# EAGLE design FUENTE ESTACION TIERRA (EAGLE 5.07)
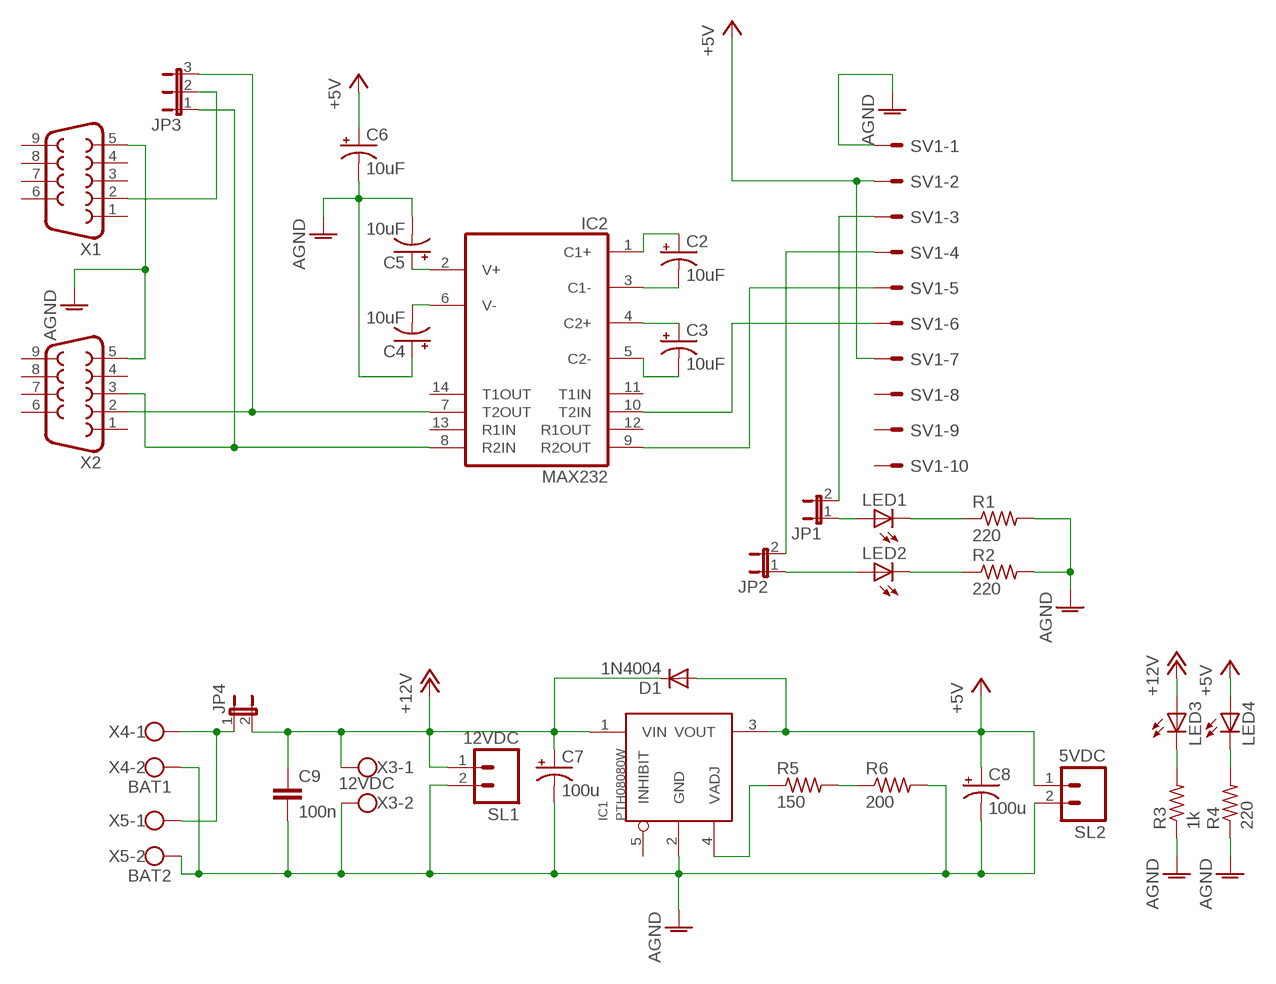
[diagram p0: schematic, sheet 1]

## Parts
C2  10uF  CPOL-USE2.5-5  [E2,5-5]
C3  10uF  CPOL-USE2.5-5  [E2,5-5]
C4  10uF  CPOL-USE2.5-5  [E2,5-5]
C5  10uF  CPOL-USE2.5-5  [E2,5-5]
C6  10uF  CPOL-USE2.5-5  [E2,5-5]
C7  100u  CPOL-USE2.5-5  [E2,5-5]
C8  100u  CPOL-USE2.5-5  [E2,5-5]
C9  100n  C5/2.5  [C5B2.5]
D1  1N4004  [DO41-10]
IC1  PTH08080W  [PLACA_XTEND_RF]
IC2  MAX232  [DIL16]
JP1  JP1E  [JP1]
JP2  JP1E  [JP1]
JP3  JP2E  [JP2]
JP4  JP1E  [JP1]
LED1  LED5MM  [LED5MM]
LED2  LED5MM  [LED5MM]
LED3  LED5MM  [LED5MM]
LED4  LED5MM  [LED5MM]
R1  220  R-US_0207/10  [0207/10]
R2  220  R-US_0207/10  [0207/10]
R3  1k  R-US_0207/10  [0207/10]
R4  220  R-US_0207/10  [0207/10]
R5  150  R-US_M1206  [M1206]
R6  200  R-US_M1206  [M1206]
SL1  12VDC  M02  [02P]
SL2  5VDC  M02  [02P]
SV1  ML10E  [ML10]
X1  F09HP  [F09HP]
X2  F09HP  [F09HP]
X3  12VDC  W237-102  [W237-102]
X4  BAT1  W237-102  [W237-102]
X5  BAT2  W237-102  [W237-102]

## Nets
+5V: C6.+ C8.+ D1.A IC1.3(VOUT) LED4.A SL2.1 SV1.2 SV1.7
+12V: C7.+ C9.1 D1.C IC1.1(VIN) JP4.2 LED3.A SL1.1 X3.1
AGND: C4.+ C5.- C6.- C7.- C8.- C9.2 IC1.2(GND) R1.2 R2.2 R3.1 R4.1 R6.2 SL1.2 SL2.2 SV1.1 X1.5 X2.5 X3.2 X4.2 X5.2
N$1: JP3.2 X1.2
N$2: JP4.1 X4.1 X5.1
N$3: C2.- IC2.3(C1-)
N$4: LED3.K(C) R3.2
N$5: LED4.K(C) R4.2
N$6: IC2.7(T2OUT) JP3.3 X2.2
N$7: IC2.8(R2IN) JP3.1 X2.3
N$8: C2.+ IC2.1(C1+)
N$9: C3.+ IC2.4(C2+)
N$10: C3.- IC2.5(C2-)
N$11: IC1.4(VADJ) R5.1
N$12: R5.2 R6.1
N$13: C5.+ IC2.2(V+)
N$14: C4.- IC2.6(V-)
N$15: IC2.10(T2IN) SV1.6
N$16: IC2.9(R2OUT) SV1.5
N$17: JP1.2 SV1.3
N$18: JP2.2 SV1.4
N$19: JP1.1 LED1.A
N$20: JP2.1 LED2.A
N$21: LED1.K(C) R1.1
N$22: LED2.K(C) R2.1
Unconnected: IC1.5(INHIBIT) IC2.11(T1IN) IC2.12(R1OUT) IC2.13(R1IN) IC2.14(T1OUT) SV1.8 SV1.9 SV1.10 X1.1 X1.3 X1.4 X1.6 X1.7 X1.8 X1.9 X2.1 X2.4 X2.6 X2.7 X2.8 X2.9

## Power pins joined to a net without a drawn wire
GND: IC2.15(GND)
VCC: IC2.16(VCC)

## Library data of the parts
C2-C8 = rcl:CPOL-US: POLARIZED CAPACITOR, American symbol
C9 = capacitor-wima:C: CAPACITOR naming: grid - package width
D1 = diode:1N4004: DIODE general purpose rectifier, 1 A
IC1 = cornejoso:PTH08080W
IC2 = maxim:MAX232: RS232 TRANSEIVER
JP1 JP2 JP4 = jumper:JP1E: JUMPER
JP3 = jumper:JP2E: JUMPER
LED1-LED4 = led:LED: LED OSRAM: - CHIPLED LG R971, LG N971, LY N971, LG Q971, LY Q971, LO R971, LY R971 LH N974, LH R974 LS Q976, LO Q976, LY Q976 LO Q996 - Hyper CHIPLED LW Q18S LB Q993, LB Q99A, LB R99A - SideLED LS A670, LO A670, LY A670, LG A670, LP A670 LB A673, LV A673, LT A673, LW A673 LH A674 LY A675 LS A676, LA A676, LO A676, LY A676, LW A676 LS A679, LY A679, LG A679 - Hyper Micro SIDELED® LS Y876, LA Y876, LO Y876, LY Y876 LT Y87S - SmartLED LW L88C, LW L88S LB L89C, LB L89S, LG L890 LS L89K, LO L89K, LY L89K LS L896, LA L896, LO L896, LY L896 - TOPLED LS T670, LO T670, LY T670, LG T670, LP T670 LSG T670, LSP T670, LSY T670, LOP T670, LYG T670 LG T671, LOG T671, LSG T671 LB T673, LV T673, LT T673, LW T673 LH T674 LS T676, LA T676, LO T676, LY T676, LB T676, LH T676, LSB T676, LW T676 LB T67C, LV T67C, LT T67C, LS T67K, LO T67K, LY T67K, LW E67C LS E67B, LA E67B, LO E67B, LY E67B, LB E67C, LV E67C, LT E67C LW T67C LS T679, LY T679, LG T679 LS T770, LO T770, LY T770, LG T770, LP T770 LB T773, LV T773, LT T773, LW T773 LH T774 LS E675, LA E675, LY E675, LS T675 LS T776, LA T776, LO T776, LY T776, LB T776 LHGB T686 LT T68C, LB T68C - Hyper Mini TOPLED® LB M676 - Mini TOPLED Santana® LG M470 LS M47K, LO M47K, LY M47K Source: http://www.osram.convergy.de LUXEON: - LUMILED® LXK2-PW12-R00, LXK2-PW12-S00, LXK2-PW14-U00, LXK2-PW14-V00 LXK2-PM12-R00, LXK2-PM12-S00, LXK2-PM14-U00 LXK2-PE12-Q00, LXK2-PE12-R00, LXK2-PE12-S00, LXK2-PE14-T00, LXK2-PE14-U00 LXK2-PB12-K00, LXK2-PB12-L00, LXK2-PB12-M00, LXK2-PB14-N00, LXK2-PB14-P00, LXK2-PB14-Q00 LXK2-PR12-L00, LXK2-PR12-M00, LXK2-PR14-Q00, LXK2-PR14-R00 LXK2-PD12-Q00, LXK2-PD12-R00, LXK2-PD12-S00 LXK2-PH12-R00, LXK2-PH12-S00 LXK2-PL12-P00, LXK2-PL12-Q00, LXK2-PL12-R00 Source: www.luxeon.com KINGBRIGHT: KA-3528ASYC Source: www.kingbright.com
R1-R6 = rcl:R-US_: RESISTOR, American symbol
SL1 SL2 = con-amp-quick:M02: AMP QUICK CONNECTOR
SV1 = con-ml:ML10E: HARTING
X1 X2 = con-subd:F09: SUB-D
X3-X5 = con-wago-500:W237-102: WAGO SCREW CLAMP

## Board
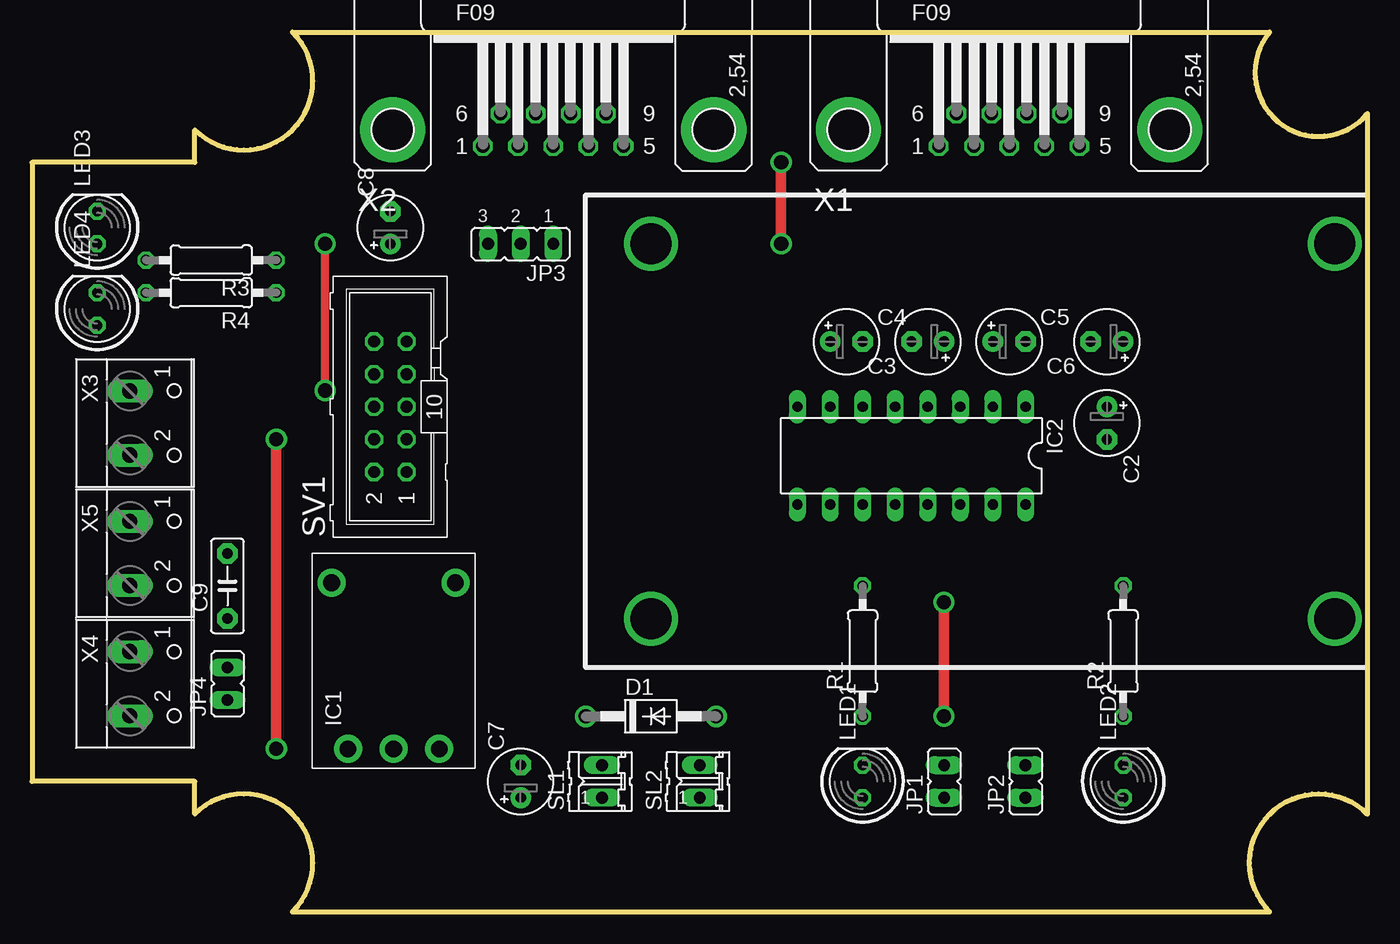
[diagram p1: board, top side]
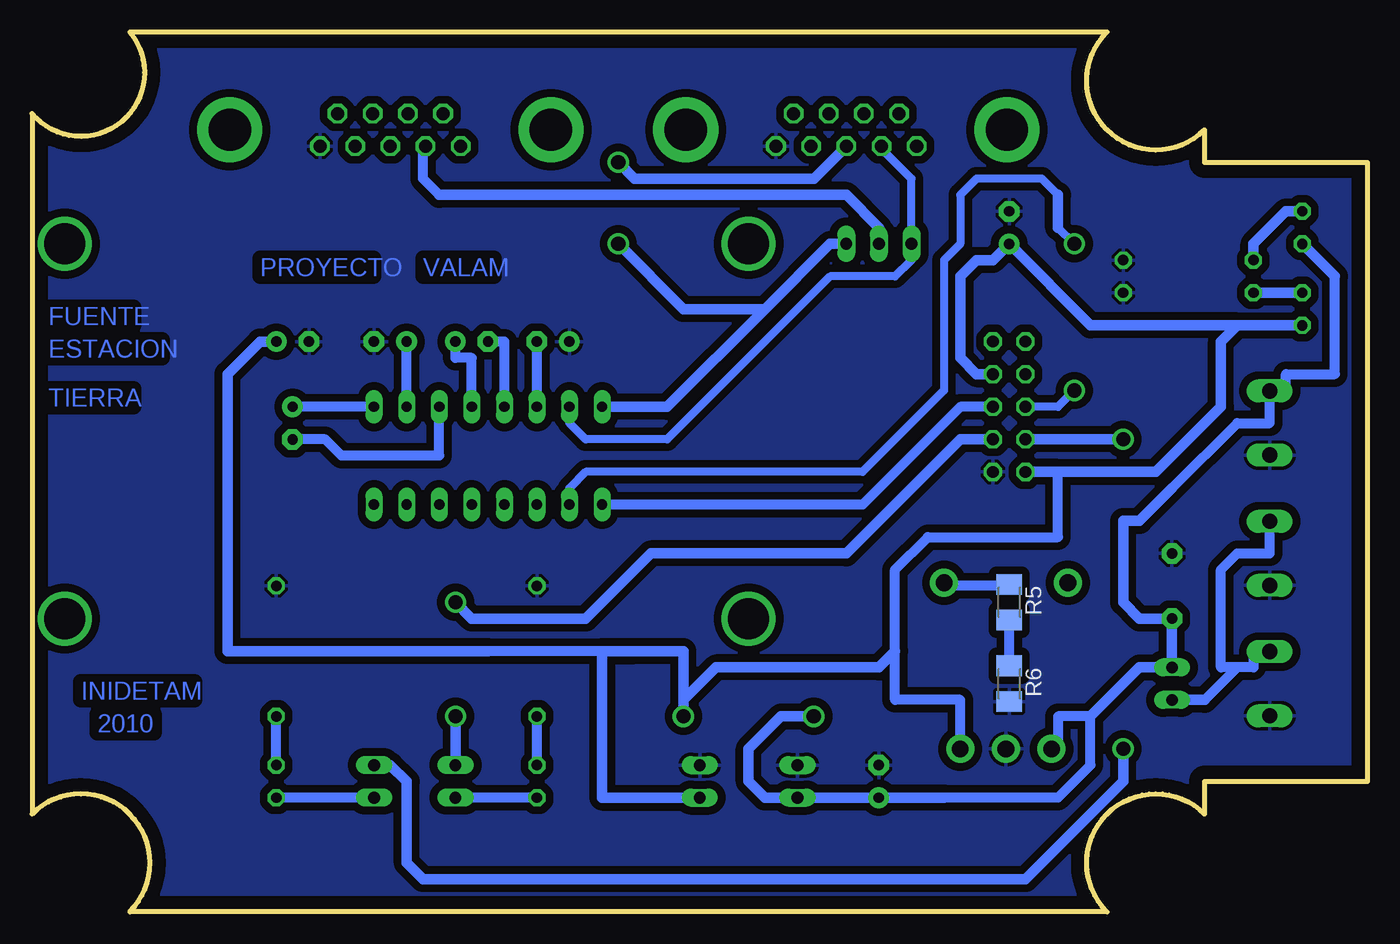
[diagram p2: board, bottom side, seen from below]

Size 104.14 x 68.58 mm. Coordinates in mm from the lower left corner, seen from the top.
Outline: 96.52,0 arc-180 104.14,7.62 104.14,62.23 arc-180 96.52,68.58 20.32,68.58 arc-180 12.7,60.96 12.7,58.42 0,58.42 0,10.16 12.7,10.16 12.7,7.62 arc-180 20.32,0 96.52,0
Copper layers (1*16): Top 0.035mm / dielectric 1.5mm / Bottom 0.035mm
Design rules "default *": minimum track width 30mil, minimum drill 24mil, track to track 8mil, track to pad 8mil, pad to pad 8mil, via to via 8mil, smd to smd 8mil, copper to edge 40mil, drill to drill 8mil, minimum pad ring 10mil, minimum via ring 8mil, stop-mask expansion 4mil, vias tented up to drill 0mil, thermal gap 10mil

### Footprints (pad centres in the part's own frame; a part is rotated, then mirrored left to right if it is on the bottom)
E2,5-5 = drill 0.813 pad 1.6 round: + -1.27,0 | drill 0.813 pad 1.6 octagon: - 1.27,0
C5B2.5 = drill 0.813 pad 1.6 octagon: 1 -2.54,0; 2 2.54,0
DO41-10 = drill 1.118 round: A 5.08,0; C -5.08,0
PLACA_XTEND_RF = drill 1.3 pad 2.184 round: 1 0,7.112; 2 0,3.556; 3 0,0; 4 12.954,-1.27; 5 12.954,8.382
DIL16 = drill 0.813 long: 1 -8.89,-3.81; 2 -6.35,-3.81; 3 -3.81,-3.81; 4 -1.27,-3.81; 5 1.27,-3.81; 6 3.81,-3.81; 7 6.35,-3.81; 8 8.89,-3.81; 9 8.89,3.81; 10 6.35,3.81; 11 3.81,3.81; 12 1.27,3.81; 13 -1.27,3.81; 14 -3.81,3.81; 15 -6.35,3.81; 16 -8.89,3.81
JP1 = drill 0.914 long: 1 0,-1.27; 2 0,1.27
JP2 = drill 0.914 long: 1 -2.54,0; 2 0,0; 3 2.54,0
LED5MM = drill 0.813 octagon: A -1.27,0; K 1.27,0
0207/10 = drill 0.813 octagon: 1 -5.08,0; 2 5.08,0
M1206 = smd 1.6 x 2: 1 -1.4,0; 2 1.4,0
02P = drill 0.914 long: 1 -1.27,0; 2 1.27,0
ML10 = drill 0.914 octagon: 1 -5.08,-1.27; 2 -5.08,1.27; 3 -2.54,-1.27; 4 -2.54,1.27; 5 0,-1.27; 6 0,1.27; 7 2.54,-1.27; 8 2.54,1.27; 9 5.08,-1.27; 10 5.08,1.27
F09HP = drill 1.016 octagon: 1 -5.486,-1.27; 2 -2.743,-1.27; 3 0,-1.27; 4 2.743,-1.27; 5 5.486,-1.27; 6 -4.115,1.27; 7 -1.372,1.27; 8 1.372,1.27; 9 4.115,1.27 | drill 3.302 pad 5.08 round: G1 -12.522,0; G2 12.522,0
W237-102 = drill 1.194 long: 1 -2.5,-1.27; 2 2.5,-1.27

### Placement (x,y rotation side)
C2  83.82,38.1 270 top
C3  69.85,44.45 180 top
C4  63.5,44.45 0 top
C5  76.2,44.45 0 top
C6  83.82,44.45 180 top
C7  38.1,10.16 90 top
C8  27.94,53.34 90 top
C9  15.24,25.4 90 top
D1  48.26,15.24 0 top
IC1  31.75,12.7 90 top
IC2  68.58,35.56 180 top
JP1  71.12,10.16 0 top
JP2  77.47,10.16 0 top
JP3  38.1,52.07 180 top
JP4  15.24,17.78 0 top
LED1  64.77,10.16 90 top
LED2  85.09,10.16 90 top
LED3  5.08,53.34 90 top
LED4  5.08,46.99 90 top
R1  64.77,20.32 90 top
R2  85.09,20.32 90 top
R3  13.97,50.8 180 top
R4  13.97,48.26 180 top
R5  27.94,24.13 270 bottom
R6  27.94,17.78 270 bottom
SL1  44.45,10.16 90 top
SL2  52.07,10.16 90 top
SV1  27.94,39.37 90 top
X1  76.2,60.96 0 top
X2  40.64,60.96 0 top
X3  8.89,38.1 270 top
X4  8.89,17.78 270 top
X5  8.89,27.94 270 top

### Tracks (layer width: path | path; a pad name or v marks a point on that pad's centre or on a via)
+5V
  Bottom 0.762: 59.69,20.32 68.58,20.32 | IC1.3 31.75,16.51 36.83,16.51 36.83,20.32 36.83,26.67 34.29,29.21 24.13,29.21 24.13,34.29
  Bottom 0.813: 10.16,45.72 LED4.A | 10.16,45.72 21.59,45.72 C8.+ 29.21,50.8 30.48,50.8 31.75,49.53 31.75,43.18 30.48,41.91 SV1.7 | SV1.2 24.13,34.29 16.51,34.29 11.43,39.37 11.43,44.45 10.16,45.72 | 68.58,20.32 88.9,20.32 88.9,41.91 86.36,44.45 C6.+ | 59.69,20.32 57.15,20.32 | SL2.1 59.69,8.89 59.69,20.32 | 36.83,20.32 38.1,19.05 50.8,19.05 53.34,16.51 | 53.34,16.51 D1.A | 53.34,16.51 53.34,20.32 59.69,20.32
+12V
  Bottom 0.762: 2.54,49.53 2.54,41.91 6.35,41.91 6.35,40.64 7.62,40.64 X3.1 7.62,38.1 10.16,38.1 15.24,33.02 | IC1.1 24.13,12.7 24.13,15.24 21.59,15.24 21.59,11.43 24.13,8.89 33.02,8.89 | JP4.2 C9.1
  Bottom 0.813: 2.54,49.53 LED3.A | 21.59,15.24 17.78,19.05 JP4.2 C9.1 17.78,22.86 19.05,24.13 19.05,30.48 17.78,30.48 15.24,33.02 | 33.02,8.89 C7.+ SL1.1 46.99,8.89 48.26,10.16 48.26,12.7 45.72,15.24 D1.C
AGND
  pour Bottom (isolate 0.61): 0,58.42 12.7,58.42 12.7,60.96 13.97,59.69 15.24,58.42 17.78,58.42 20.32,60.96 22.86,63.5 22.86,66.04 20.32,68.58 96.52,68.58 95.25,67.31 95.25,64.77 95.25,63.5 96.52,62.23 99.06,59.69 101.6,59.69 104.14,62.23 104.14,7.62 102.87,8.89 99.06,8.89 97.79,8.89 96.52,7.62 93.98,5.08 93.98,2.54 96.52,0 20.32,0 22.86,2.54 22.86,5.08 17.78,10.16 15.24,10.16 12.7,7.62 12.7,10.16 0,10.16
N$1
  Bottom 0.762: 72.39,55.88 73.66,57.15 73.66,59.69 X1.2
  Bottom 0.813: JP3.2 38.1,53.34 40.64,55.88 72.39,55.88
N$2
  Bottom 0.762: 10.16,19.05 12.7,16.51 | 10.16,19.05 8.89,19.05 8.89,20.32 7.62,20.32 X4.1 | 10.16,19.05 11.43,19.05 11.43,26.67 10.16,27.94 7.62,27.94 X5.1 7.62,30.48
  Bottom 0.813: 12.7,16.51 JP4.1
N$3
  Bottom 0.762: IC2.3 72.39,35.56 80.01,35.56 81.28,36.83 C2.-
N$4
  Bottom 0.813: LED3.K 6.35,54.61 8.89,52.07 R3.2
N$5
  Bottom 0.813: LED4.K R4.2
N$6
  Bottom 0.61: IC2.7 62.23,38.1 60.96,36.83 54.61,36.83 41.91,49.53 36.83,49.53 35.56,50.8 JP3.3 35.56,57.15 37.9,59.49 X2.2
N$7  (via drill 1.1 pad 1.42)
  Top 0.813: v58.42,52.07 v58.42,58.42
  Bottom 0.813: JP3.1 41.91,52.07 46.99,46.99 | 46.99,46.99 54.61,39.37 IC2.8 | X2.3 43.18,57.15 57.15,57.15 v58.42,58.42 | 46.99,46.99 53.34,46.99 v58.42,52.07
N$8
  Bottom 0.762: IC2.1 C2.+
N$9
  Bottom 0.762: IC2.4 69.85,43.18 71.12,43.18 C3.+
N$10
  Bottom 0.762: IC2.5 67.31,44.45 C3.-
N$11
  Bottom 0.762: R5.1 27.94,25.4 33.02,25.4 IC1.4
N$12
  Bottom 0.762: 27.94,19.05 R6.1 R5.2 27.94,22.86
N$13
  Bottom 0.762: IC2.2 C5.+
N$14
  Bottom 0.762: IC2.6 C4.-
N$15  (via drill 1.1 pad 0.81)
  Top 0.61: v22.86,40.64 v22.86,52.07
  Bottom 0.61: IC2.10 62.23,33.02 60.96,34.29 39.37,34.29 33.02,40.64 33.02,50.8 31.75,52.07 31.75,55.88 30.48,57.15 25.4,57.15 24.13,55.88 | v22.86,52.07 24.13,53.34 | SV1.6 24.13,39.37 v22.86,40.64
  Bottom 0.813: 24.13,53.34 24.13,55.88
N$16
  Bottom 0.762: IC2.9 39.37,31.75 31.75,39.37 SV1.5
N$17  (via drill 1.1 pad 1.42)
  Top 0.813: v71.12,24.13 v71.12,15.24
  Bottom 0.813: SV1.3 31.75,36.83 40.64,27.94 55.88,27.94 60.96,22.86 69.85,22.86 v71.12,24.13 | v71.12,15.24 JP1.2
N$18  (via drill 1.1 pad 1.42)
  Top 0.813: v19.05,12.7 v19.05,36.83
  Bottom 0.813: JP2.2 76.2,11.43 74.93,10.16 74.93,3.81 73.66,2.54 26.67,2.54 19.05,10.16 v19.05,12.7 | v19.05,36.83 SV1.4
N$19
  Bottom 0.762: LED1.A JP1.1
N$20
  Bottom 0.762: JP2.1 LED2.A
N$21
  Bottom 0.762: LED1.K R1.1
N$22
  Bottom 0.762: LED2.K R2.1
N$23  (via drill 3.2 pad 3.81)
  other vias: 101.6,52.07
N$24  (via drill 3.2 pad 3.81)
  other vias: 48.26,52.07
N$25  (via drill 3.2 pad 3.81)
  other vias: 48.26,22.86
N$26  (via drill 3.2 pad 3.81)
  other vias: 101.6,22.86

### Text on the board
Bottom: VALAM | PROYECTO | FUENTE | ESTACION | TIERRA | INIDETAM | 2010